# EAGLE design duel_mems_mic (EAGLE 9.5.1)
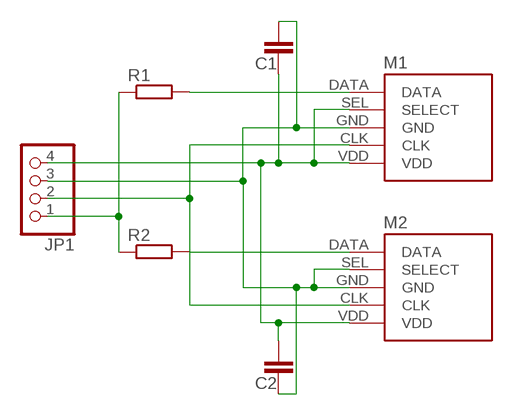
[diagram p0: schematic, sheet 1]

## Parts
C1  C-EUC0402  [C0402]
C2  C-EUC0402  [C0402]
JP1  PINHD-1X4  [1X04]
M1  MEMS_MIC_IM69D130-DS  [IM69D130-DS]
M2  MEMS_MIC_IM69D130-DS  [IM69D130-DS]
R1  R-EU_R0402  [R0402]
R2  R-EU_R0402  [R0402]

## Nets
GND: C1.1 C2.2 JP1.3 M1.GND M2.GND M2.SEL(SELECT)
N$1: M1.DATA R1.2
N$2: JP1.1 R1.1 R2.1
N$3: C1.2 C2.1 JP1.4 M1.SEL(SELECT) M1.VDD M2.VDD
N$5: M2.DATA R2.2
N$6: JP1.2 M1.CLK M2.CLK

## Library data of the parts
C1 C2 = resistor:C-EU: CAPACITOR, European symbol
JP1 = pinhead:PINHD-1X4: PIN HEADER
M1 M2 = mems_mics:MEMS_MIC_IM69D130-DS
R1 R2 = resistor:R-EU_: RESISTOR, European symbol

## Board
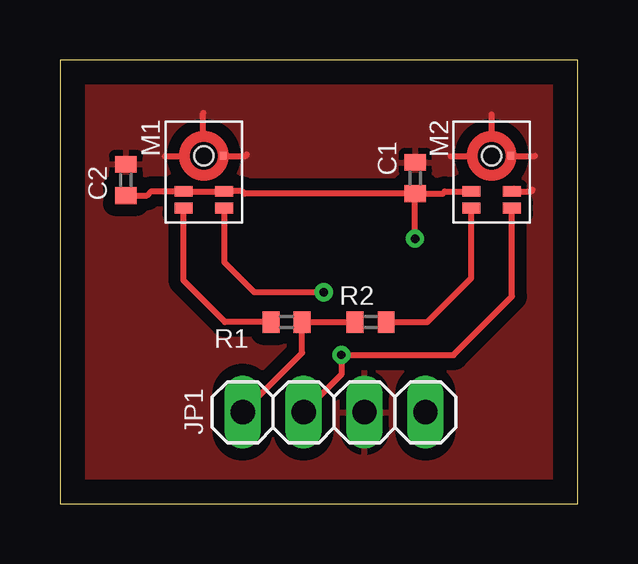
[diagram p1: board, top side]
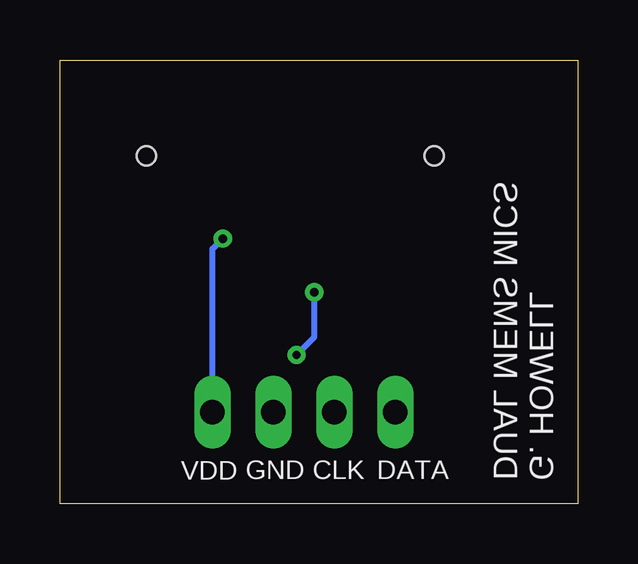
[diagram p2: board, bottom side, seen from below]

Size 21.6 x 18.5 mm. Coordinates in mm from the lower left corner, seen from the top.
Outline: 0,0 21.6,0 21.6,18.5 0,18.5 0,0
Copper layers (1*16): Top 0.035mm / dielectric 1.5mm / Bottom 0.035mm
Design rules "jlc_pcb": minimum track width 5mil, minimum drill 0.2mm, track to track 5mil, track to pad 6mil, pad to pad 6mil, via to via 6mil, smd to smd 6mil, copper to edge 40mil, drill to drill 6mil, minimum pad ring 10mil, minimum via ring 8mil, stop-mask expansion 4mil, vias tented up to drill 0mil, thermal gap 10mil

### Footprints (pad centres in the part's own frame; a part is rotated, then mirrored left to right if it is on the bottom)
C0402 = smd 0.7 x 0.9: 1 -0.65,0; 2 0.65,0
1X04 = drill 1.016 long: 1 -3.81,0; 2 -1.27,0; 3 1.27,0; 4 3.81,0
IM69D130-DS = smd 0.75 x 0.45: CLK -0.85,2.18; DATA 0.85,2.18; SEL -0.85,1.48; VDD 0.85,1.48 | smd 0.3 x 0.3: GND -0.8,0 | hole 0.8: 0,0
R0402 = smd 0.7 x 0.9: 1 -0.65,0; 2 0.65,0

### Placement (x,y rotation side)
C1  14.82,13.58 270 top
C2  2.75,13.5 90 top
JP1  11.43,3.81 0 top
M1  6,14.5 180 top
M2  18,14.5 180 top
R1  9.45,7.57 180 top
R2  12.95,7.57 0 top

### Tracks (layer width: path | path; a pad name or v marks a point on that pad's centre or on a via)
GND
  Top 0.254: M1.GND 7.74,14.5 7.8,14.55 | M2.GND 19.81,14.5 | M2.SEL 19.65,13.02 19.71,13.08 | 5.26,14.48 4.37,14.48 | 5.97,15.29 5.97,16.28 | 17.22,14.48 16.28,14.48 | 18.01,15.29 18.01,16.23
  pour Top (isolate 0.5): -0.5,19.11 22.23,19.11 22.23,-0.6 -0.5,-0.6
N$1
  Top 0.254: R1.2 6.88,7.57 5.15,9.3 M1.DATA
N$2
  Top 0.254: JP1.1 10.1,6.29 R1.1 R2.1
N$3  (via drill 0.35)
  Top 0.152: 17.07,13.11 M2.VDD | M1.VDD 5.03,12.95 4.98,13.01 | 2.9,12.95 C2.1 | 6.86,13.11 M1.SEL
  Top 0.254: C2.1 3.63,12.85 3.81,13.03 4.95,13.03 4.98,13.01 | 14.83,12.93 C1.2 7.7,12.93 7.59,13.03 M1.SEL | 14.83,12.93 15.95,12.93 16.04,13.02 M2.VDD | v14.81,11.05 14.81,12.9 14.83,12.93 | M1.VDD M1.SEL
  Bottom 0.254: JP1.4 15.24,10.62 v14.81,11.05
N$5
  Top 0.152: 17.07,12.34 M2.DATA
  Top 0.254: R2.2 15.32,7.57 17.15,9.4 M2.DATA
N$6  (via drill 0.35)
  Top 0.254: M1.CLK 6.85,10.07 8.1,8.81 v11,8.81 | JP1.2 11.73,5.38 v11.73,6.2 16.41,6.2 18.85,8.64 M2.CLK
  Bottom 0.254: v11,8.81 11,6.93 v11.73,6.2

### Text on the board
bNames: G. HOWELL / DUAL MEMS MICS | DATA | CLK | GND | VDD